# EAGLE schematic nixieshield-v1.0 (EAGLE 7.6.0)
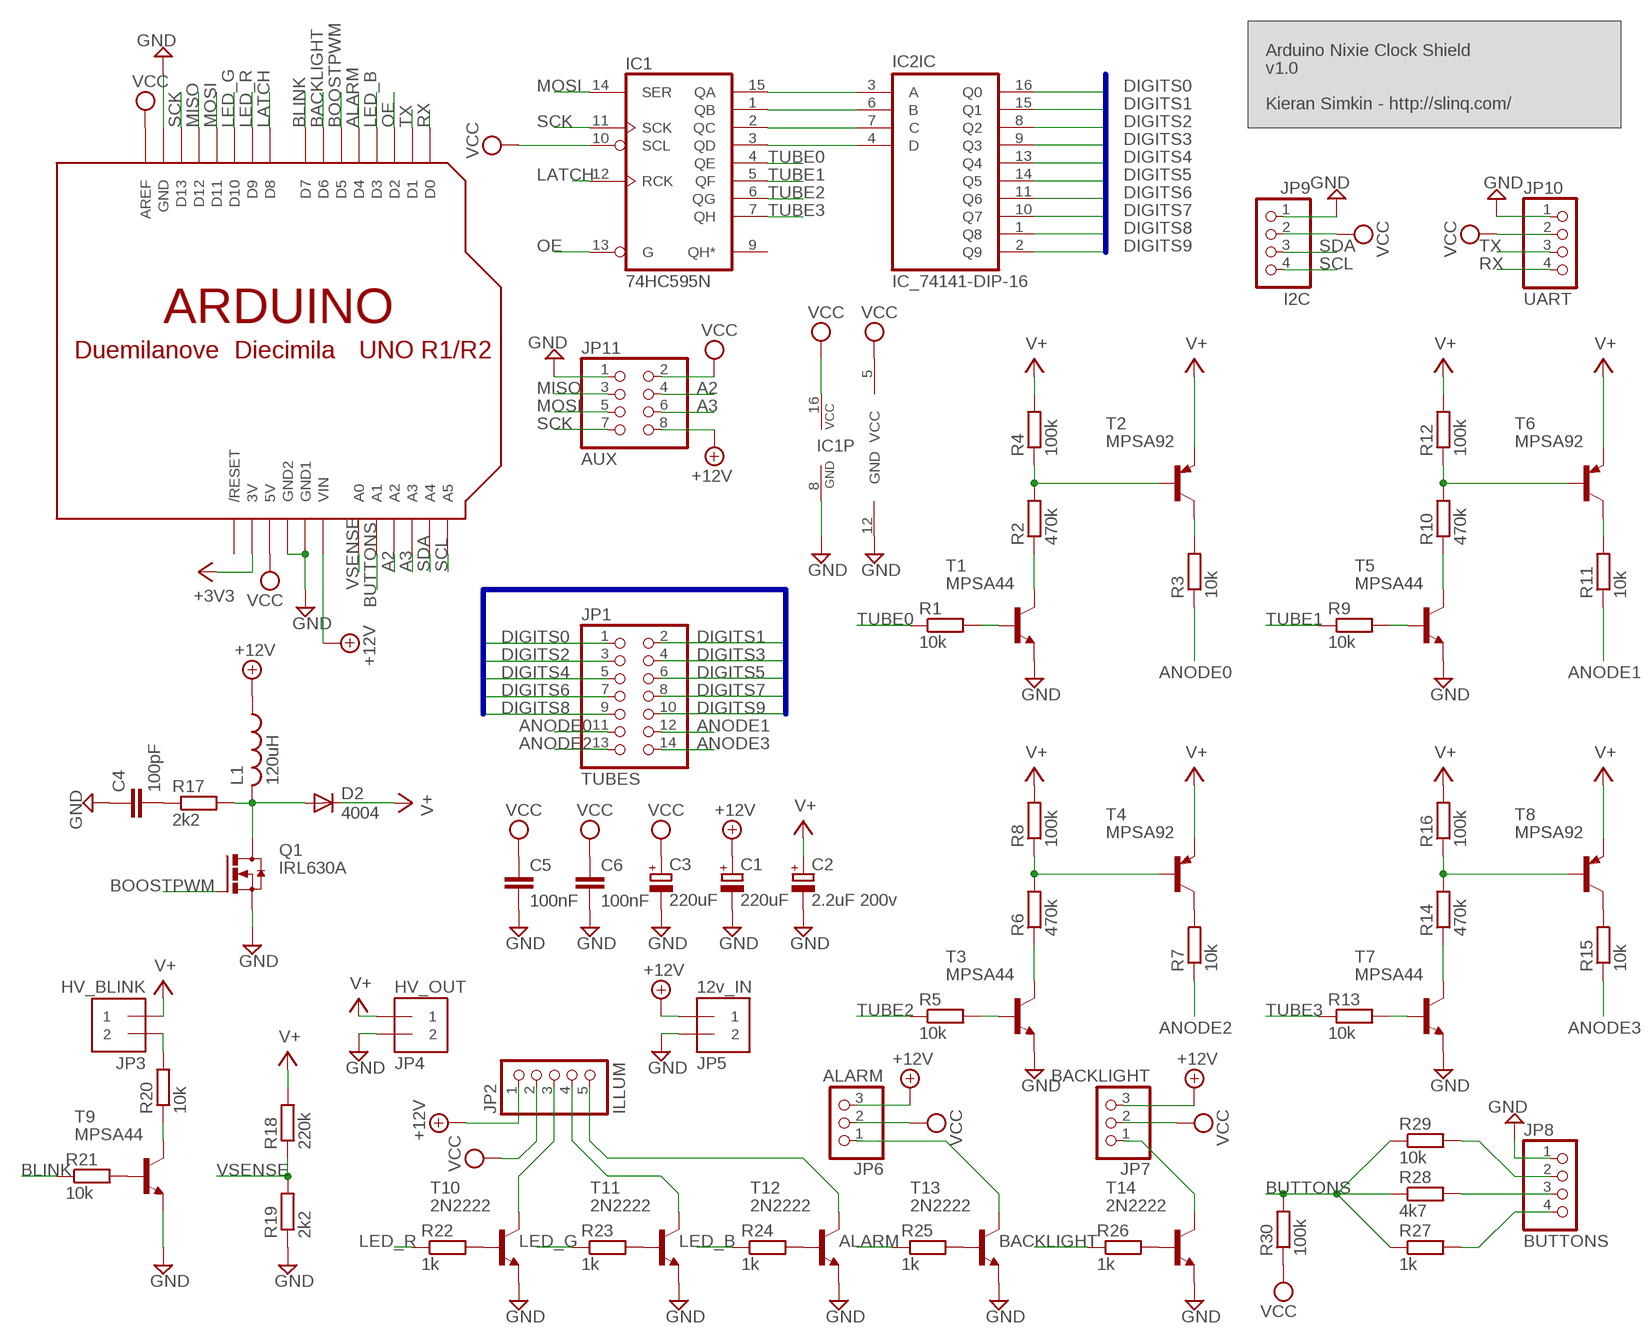
[diagram p0: schematic, sheet 1]

## Parts
C1  220uF  CPOL-EUE1.8-4  [E1,8-4]
C2  2.2uF 200v  CPOL-EUE1.8-4  [E1,8-4]
C3  220uF  CPOL-EUE1.8-4  [E1,8-4]
C4  100pF  C-EU025-024X044  [C025-024X044]
C5  100nF  C-EU025-024X044  [C025-024X044]
C6  100nF  C-EU025-024X044  [C025-024X044]
D2  4004  DIODE-D-7.5  [D-7.5]
IC1  74HC595N  [DIL16]
IC2  IC_74141-DIP-16  [DIL16]
JP1  TUBES  PINHD-2X7  [2X07]
JP2  ILLUM  PINHD-1X5  [1X05]
JP3  HV_BLINK  1X2-3.5MM  [1X2-3.5MM]
JP4  HV_OUT  1X2-3.5MM  [1X2-3.5MM]
JP5  12v_IN  1X2-3.5MM  [1X2-3.5MM]
JP6  ALARM  PINHD-1X3  [1X03]
JP7  BACKLIGHT  PINHD-1X3  [1X03]
JP8  BUTTONS  PINHD-1X4  [1X04]
JP9  I2C  PINHD-1X4  [1X04]
JP10  UART  PINHD-1X4  [1X04]
JP11  AUX  PINHD-2X4  [2X04]
L1  120uH  L-US0207/2V  [0207/2V]
Q1  IRL630A  [TO220AV]
R1  10k  R-EU_0204/7  [0204/7]
R2  470k  R-EU_0204/7  [0204/7]
R3  10k  R-EU_0204/7  [0204/7]
R4  100k  R-EU_0204/7  [0204/7]
R5  10k  R-EU_0204/7  [0204/7]
R6  470k  R-EU_0204/7  [0204/7]
R7  10k  R-EU_0204/7  [0204/7]
R8  100k  R-EU_0204/7  [0204/7]
R9  10k  R-EU_0204/7  [0204/7]
R10  470k  R-EU_0204/7  [0204/7]
R11  10k  R-EU_0204/7  [0204/7]
R12  100k  R-EU_0204/7  [0204/7]
R13  10k  R-EU_0204/7  [0204/7]
R14  470k  R-EU_0204/7  [0204/7]
R15  10k  R-EU_0204/7  [0204/7]
R16  100k  R-EU_0204/7  [0204/7]
R17  2k2  R-EU_0204/7  [0204/7]
R18  220k  R-EU_0204/7  [0204/7]
R19  2k2  R-EU_0204/7  [0204/7]
R20  10k  R-EU_0204/7  [0204/7]
R21  10k  R-EU_0204/7  [0204/7]
R22  1k  R-EU_0204/7  [0204/7]
R23  1k  R-EU_0204/7  [0204/7]
R24  1k  R-EU_0204/7  [0204/7]
R25  1k  R-EU_0204/7  [0204/7]
R26  1k  R-EU_0204/7  [0204/7]
R27  1k  R-EU_0204/7  [0204/7]
R28  4k7  R-EU_0204/7  [0204/7]
R29  10k  R-EU_0204/7  [0204/7]
R30  100k  R-EU_0204/7  [0204/7]
T1  MPSA44  MPSA44-NPN-TO92-EBC  [TO92-EBC]
T2  MPSA92  MPSA92-PNP-TO92-EBC  [TO92-EBC]
T3  MPSA44  MPSA44-NPN-TO92-EBC  [TO92-EBC]
T4  MPSA92  MPSA92-PNP-TO92-EBC  [TO92-EBC]
T5  MPSA44  MPSA44-NPN-TO92-EBC  [TO92-EBC]
T6  MPSA92  MPSA92-PNP-TO92-EBC  [TO92-EBC]
T7  MPSA44  MPSA44-NPN-TO92-EBC  [TO92-EBC]
T8  MPSA92  MPSA92-PNP-TO92-EBC  [TO92-EBC]
T9  MPSA44  MPSA44-NPN-TO92-EBC  [TO92-EBC]
T10  2N2222  [TO92-EBC-OVAL]
T11  2N2222  [TO92-EBC-OVAL]
T12  2N2222  [TO92-EBC-OVAL]
T13  2N2222  [TO92-EBC-OVAL]
T14  2N2222  [TO92-EBC-OVAL]
U$1  ARDUINOUNO  [ARDUINO]

## Nets
+3V3: U$1.3V
+12V: C1.+ JP2.1 JP5.1 JP6.3 JP7.3 JP11.8 L1.1 U$1.VIN
A2: JP11.4 U$1.A2
A3: JP11.6 U$1.A3
ALARM: R25.1 U$1.D4
ANODE0: JP1.11 R3.1
ANODE1: JP1.12 R11.1
ANODE2: JP1.13 R7.1
ANODE3: JP1.14 R15.1
BACKLIGHT: R26.1 U$1.D6
BLINK: R21.1 U$1.D7
BOOSTPWM: Q1.B(G) U$1.D5
BUTTONS: R27.1 R28.1 R29.1 R30.2 U$1.A1
DIGITS0: IC2.16(IC:Q0) JP1.1
DIGITS1: IC2.15(IC:Q1) JP1.2
DIGITS2: IC2.8(IC:Q2) JP1.3
DIGITS3: IC2.9(IC:Q3) JP1.4
DIGITS4: IC2.13(IC:Q4) JP1.5
DIGITS5: IC2.14(IC:Q5) JP1.6
DIGITS6: IC2.11(IC:Q6) JP1.7
DIGITS7: IC2.10(IC:Q7) JP1.8
DIGITS8: IC2.1(IC:Q8) JP1.9
DIGITS9: IC2.2(IC:Q9) JP1.10
GND: C1.- C2.- C3.- C4.1 C5.2 C6.2 IC1.8(GND) IC2.12(SUPPLY:GND) JP4.2 JP5.2 JP8.1 JP9.1 JP10.1 JP11.1 Q1.E(S) R19.1 T1.E T3.E T5.E T7.E T9.E T10.E T11.E T12.E T13.E T14.E U$1.GND U$1.GND1 U$1.GND2
LATCH: IC1.12(RCK) U$1.D8
LED_B: R24.1 U$1.D3
LED_G: R23.1 U$1.D10
LED_R: R22.1 U$1.D9
MISO: JP11.3 U$1.D12
MOSI: IC1.14(SER) JP11.5 U$1.D11
N$1: IC1.1(QB) IC2.6(IC:B)
N$2: IC1.2(QC) IC2.7(IC:C)
N$3: IC1.3(QD) IC2.4(IC:D)
N$4: IC1.15(QA) IC2.3(IC:A)
N$5: R2.1 T1.C
N$6: R1.2 T1.B
N$7: R3.2 T2.C
N$8: R2.2 R4.1 T2.B
N$9: R5.2 T3.B
N$10: R7.2 T4.C
N$11: R6.1 T3.C
N$12: R6.2 R8.1 T4.B
N$13: R9.2 T5.B
N$14: R11.2 T6.C
N$15: R10.1 T5.C
N$16: R10.2 R12.1 T6.B
N$17: R13.2 T7.B
N$18: R15.2 T8.C
N$19: R14.1 T7.C
N$20: R14.2 R16.1 T8.B
N$21: D2.A L1.2 Q1.C(D) R17.2
N$22: C4.2 R17.1
N$23: R20.1 T9.C
N$24: R21.2 T9.B
N$25: R22.2 T10.B
N$26: R23.2 T11.B
N$27: R24.2 T12.B
N$28: R25.2 T13.B
N$29: JP2.3 T10.C
N$30: JP2.4 T11.C
N$31: JP2.5 T12.C
N$32: JP3.2 R20.2
N$33: JP6.1 T13.C
N$34: R26.2 T14.B
N$35: JP7.1 T14.C
N$36: JP8.4 R27.2
N$37: JP8.3 R28.2
N$38: JP8.2 R29.2
OE: IC1.13(G) U$1.D2
RX: JP10.4 U$1.D0
SCK: IC1.11(SCK) JP11.7 U$1.D13
SCL: JP9.4 U$1.A5
SDA: JP9.3 U$1.A4
TUBE0: IC1.4(QE) R1.1
TUBE1: IC1.5(QF) R9.1
TUBE2: IC1.6(QG) R5.1
TUBE3: IC1.7(QH) R13.1
TX: JP10.3 U$1.D1
V+: C2.+ D2.C JP3.1 JP4.1 R4.2 R8.2 R12.2 R16.2 R18.2 T2.E T4.E T6.E T8.E
VCC: C3.+ C5.1 C6.1 IC1.10(SCL) IC1.16(VCC) IC2.5(SUPPLY:VCC) JP2.2 JP6.2 JP7.2 JP9.2 JP10.2 JP11.2 R30.1 U$1.5V U$1.AREF
VSENSE: R18.1 R19.2 U$1.A0
Unconnected: IC1.9(QH*) U$1.RESET(/RESET)

## Buses
DIGITS[0..9]

## Notes on the sheet
- Arduino Nixie Clock Shield
- v1.0
- Kieran Simkin - http://slinq.com/

## Library data of the parts
C1-C3 = resistor:CPOL-EU: POLARIZED CAPACITOR, European symbol
C4-C6 = resistor:C-EU: CAPACITOR, European symbol
D2 = diode:DIODE-: DIODE
IC1 = 74xx-eu:74*595: 8-bit SHIFT REGISTER, output latch
IC2 = dp_devices:IC_74141: BCD to decimal decoder
JP1 = pinhead:PINHD-2X7: PIN HEADER
JP2 = pinhead:PINHD-1X5: PIN HEADER
JP3-JP5 = adafruit:1X2: 3.5mm Terminal block http://www.ladyada.net/library/pcb/eaglelibrary.html
JP6 JP7 = pinhead:PINHD-1X3: PIN HEADER
JP8-JP10 = pinhead:PINHD-1X4: PIN HEADER
JP11 = pinhead:PINHD-2X4: PIN HEADER
L1 = rcl:L-US: INDUCTOR, American symbol
Q1 = transistor-power:IRL630A
R1-R30 = resistor:R-EU_: RESISTOR, European symbol
T1 T3 T5 T7 T9 = transistor:*-NPN-: NPN Transistror BF959 corrected 2008.03.06
T2 T4 T6 T8 = transistor:*-PNP-: PNP Transistror
T10-T14 = adafruit:2N2222: NPN TRANSISTOR Big oval pads
U$1 = adafruit:ARDUINO: Arduino Diecimila/Duemilanove Make a shield with ease, this package has all the named pins as well as the two mounting drill holes and an outline of the USB and DC power connector. The outline is on the DIMENSION layer, so if your board house uses it they will cut the outline to match. http://www.ladyada.net/library/pcb/eaglelibrary.html